# Altium schematic sheet PAGE2 - POWER.SchDoc
size A3; DocumentNumber: 2; SheetNumber: 2; SheetTotal: 2
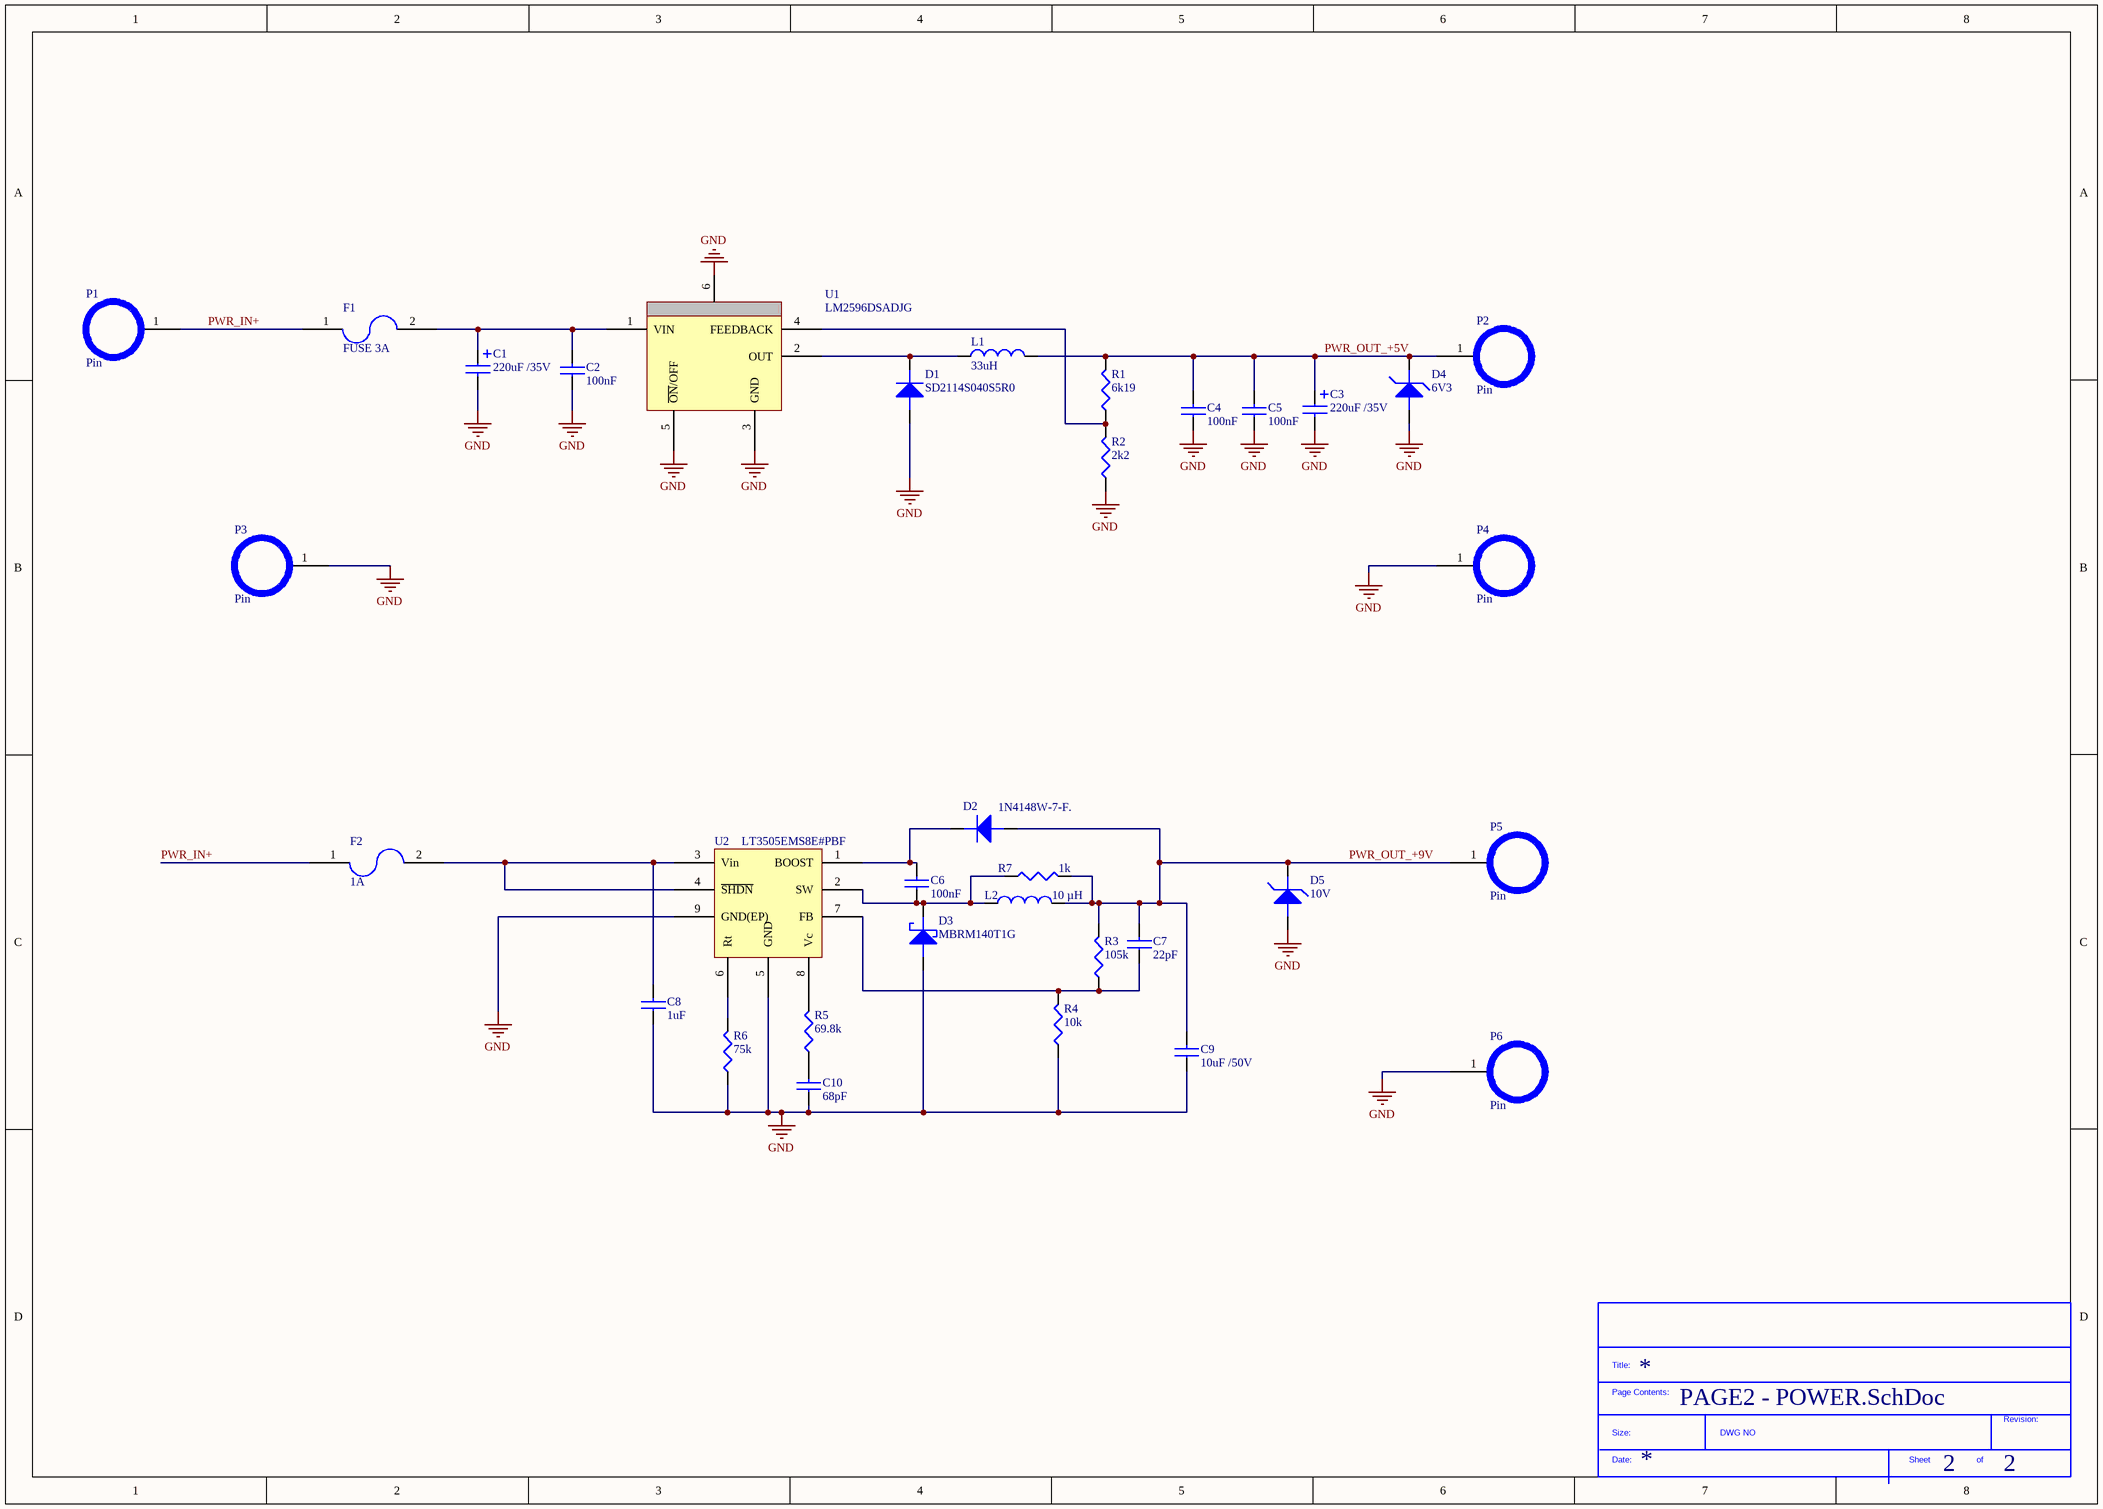
[diagram p0: PAGE2 - POWER.SchDoc]

## Parts
*?  SDTitleBlock  (value not drawn)  (graphical)
C1  220uF /35V  [Cap Can F]
C2  100nF  [CAP0603]
C3  220uF /35V  [Cap Can F]
C4  100nF  [CAP0603]
C5  100nF  [CAP0603]
C6  100nF  [CAP0603]
C7  22pF  [CAP0603]
C8  1uF  [CAP0603]
C9  10uF /50V  [CAP1206]
C10  68pF  [CAP0603]
D1  SD2114S040S5R0
D2  1N4148W-7-F.  [SOD123]
D3  MBRM140T1G  [POWERMITE]
D4  6V3
D5  10V
F1  FUSE 3A  [FUSE0805]
F2  1A  [FUSE0805]
L1  33uH  [IND DR125 Series]
L2  10 µH  [INDP6545X29N]
P1  Pin  [PCBComponent_1]  (no BOM)
P2  Pin  [PCBComponent_1]  (no BOM)
P3  Pin  [PCBComponent_1]  (no BOM)
P4  Pin  [PCBComponent_1]  (no BOM)
P5  Pin  [PCBComponent_1]  (no BOM)
P6  Pin  [PCBComponent_1]  (no BOM)
R1  6k19  [RES0603]
R2  2k2  [RES0603]
R3  105k  [RES0603]
R4  10k  [RES0603]
R5  69.8k  [RES0603]
R6  75k  [RES0603]
R7  1k  [RES0603]
U1  LM2596DSADJG  [KTT0005B]
U2  LT3505EMS8E#PBF  [MSOP8E]

## Nets
GND: C1.2 C2.1 C3.2 C4.1 C5.1 C8.1 C9.1 C10.1 D1.2(ANODE) D3.2(ANODE) D4.2(ANODE) D5.2(ANODE) P3.1 P4.1 P6.1 R2.1 R4.1 R6.1 U1.3(GND) U1.5(~{ON}/OFF) U1.6(EP) U2.5(GND) U2.9(GND(EP))
PWR_IN+: F1.1 F2.1 P1.1
PWR_OUT_+5V: C3.1 C4.2 C5.2 D4.1(cathode) L1.2 P2.1 R1.2
PWR_OUT_+9V: C7.2 C9.2 D2.2(ANODE) D5.1(cathode) L2.2 P5.1 R3.2 R7.2
NetC1_1: C1.1 C2.2 F1.2 U1.1(VIN)
NetC6_1: C6.1 D3.1(cathode) L2.1 R7.1 U2.2(SW)
NetC6_2: C6.2 D2.1(cathode) U2.1(BOOST)
NetC7_1: C7.1 R3.1 R4.2 U2.7(FB)
NetC8_2: C8.2 F2.2 U2.3(Vin) U2.4(~{SHDN})
NetC10_2: C10.2 R5.1
NetD1_1: D1.1(cathode) L1.1 U1.2(OUT)
NetR1_1: R1.1 R2.2 U1.4(FEEDBACK)
NetR5_2: R5.2 U2.8(Vc)
NetR6_2: R6.2 U2.6(Rt)

## Notes on the sheet
- (in symbol SDTitleBlock) Title:; Page Contents:; Revision:; Size:; DWG NO; Date:; Sheet; of

## Library data of the parts
C1 C3 = 220uF /35V: PANASONIC ELECTRONIC COMPONENTS - EEEFK1V221P - CAP, ALU ELEC, 220UF, 35V, SMD; Supplier 1: Farnell; Manufacturer: PANASONIC ELECTRONIC COMPONENTS; Manufacturer Part Number: EEEFK1V221P; RoHS: YES; Stock 1: 9435; Pricing 1: 1=0.596, 10=0.364, 50=0.262, 100=0.218, 200=0.187 (GBP); ComponentLink1URL: http://www.farnell.com/datasheets/2002520.pdf?_ga=1.182585071.878552343.1493119789; ComponentLink1Description: http://www.farnell.com/datasheets/2002520.pdf?_ga=1.182585071.878552343.1493119789; ComponentLink2URL: http://www.farnell.com/cad/1703920.zip; ComponentLink2Description: http://www.farnell.com/cad/1703920.zip; ComponentLink3URL: http://www.farnell.com/datasheets/2042572.pdf; ComponentLink3Description: http://www.farnell.com/datasheets/2042572.pdf; Supplier Part Number 1: 9695877
C2 C4-C6 = 100nF: MURATA - GRM188R71C104KA01J - CAP, MLCC, X7R, 0.1UF, 16V, 0603; Ceramic Capacitor Case: 0603 [1608 Metric]; Capacitance: 0.1; Voltage Rating: 16; Capacitance Tolerance: ± 10%; Dielectric Characteristic: X7; Product Range: GRM Series; SVHC: No SVHC (20-Jun-2016; Supplier 1: Farnell; Manufacturer: MURATA; Manufacturer Part Number: GRM188R71C104KA01J; RoHS: YES; Stock 1: 18297; Pricing 1: 10=0.0145, 100=0.0126, 500=0.0081, 2500=0.0059, 5000=0.0052, 10000=0.0046, 50000=0.0036, 100000=0.0035 (GBP); Packaging: Cut Tape; Operating Temperature Min: -55; Operating Temperature Max: 125; Automotive Qualification Standard: -; MSL: MSL 1 - Unlimited; ComponentLink1URL: http://www.farnell.com/datasheets/2189124.pdf; ComponentLink1Description: http://www.farnell.com/datasheets/2189124.pdf; Supplier Part Number 1: 2688519
C7 = 22pF: MURATA - GRM1885C1H220JA01D - CAP, MLCC, C0G/NP0, 22PF, 50V, 0603; Ceramic Capacitor Case: 0603 [1608 Metric]; Capacitance: 22; Voltage Rating: 50; Capacitance Tolerance: ± 5%; Product Range: GRM Series; SVHC: No SVHC (17-Dec-2015); Capacitor Terminals: SMD<!--FANDB--><div class="features-and-benefits-container"><div class="features-and-benefits-description"><span class="features-benefits-value">The Murata GRM series capacitors are Multilayer Ceramic Chip Capacitors (MLCC) used for general purpose applications. These MLCC capacitors are classified into temperature compensating and high dielectric constant types depending on the change in electrostatic capacitance due to change in temperature. The temperature compensating capacitors feature a small rate of change in electrostatic capacitance as the temperature changes and are used for applications such as filters and high frequency circuit matching. The high dielectric constant capacitors use materials with a high dielectric constant and feature a large electrostatic capacitance. Typical applications are power supply decoupling and smoothing circuits.</span></div><div class="features-and-benefits-list"><ul class="features-and-benefits-list-list"><li class="features-and-benefits-list-item">Large capacity and small size in a multilayer structure</li><li class="features-and-benefits-list-item">Capacitance value ranging from 0.1pF to 220?F</li><li class="features-and-benefits-list-item">Tin plated external electrodes, excellent solderability</li><li class="features-and-benefits-list-item">Provides good high frequency characteristics</li><li class="features-and-benefits-list-item">Excellent pulse response</li><li class="features-and-benefits-list-item">High reliability</li><li class="features-and-benefits-list-item">Capacitor size varies from 0.4×0.2mm to 5.7×5.0mm</li><li class="features-and-benefits-list-item">Rated voltage of 2.5VDC to 3.15; Supplier 1: Farnell; Manufacturer: MURATA; Manufacturer Part Number: GRM1885C1H220JA01D; RoHS: YES; Stock 1: 4736; Pricing 1: 10=0.0233, 100=0.0152, 500=0.0112, 1000=0.0088, 2000=0.0086 (GBP); Dielectric Characteristic: C0G / NP0; Packaging: Cut Tape; Operating Temperature Min: -55; Operating Temperature Max: 125; Automotive Qualification Standard: -; MSL: -; Capacitance Tolerance ±: ± 5%; ComponentLink1URL: http://www.farnell.com/datasheets/313472.pdf; ComponentLink1Description: http://www.farnell.com/datasheets/313472.pdf; ComponentLink2URL: http://www.farnell.com/datasheets/2048184.pdf; ComponentLink2Description: http://www.farnell.com/datasheets/2048184.pdf; Supplier Part Number 1: 8819831
C8 = 1uF: MURATA - GRM188R61H105KAALD - CAP, MLCC, X5R, 1UF, 50V, 0603; Ceramic Capacitor Case: 0603 [1608 Metric]; Capacitance: 1; Voltage Rating: 50; Capacitance Tolerance: ± 10%; Dielectric Characteristic: X5; Product Range: GRM Series; SVHC: No SVHC (17-Dec-2015); Capacitor Terminals: SMD<!--FANDB--><div class="features-and-benefits-container"><div class="features-and-benefits-description"><span class="features-benefits-value">The Murata GRM series capacitors are Multilayer Ceramic Chip Capacitors (MLCC) used for general purpose applications. These MLCC capacitors are classified into temperature compensating and high dielectric constant types depending on the change in electrostatic capacitance due to change in temperature. The temperature compensating capacitors feature a small rate of change in electrostatic capacitance as the temperature changes and are used for applications such as filters and high frequency circuit matching. The high dielectric constant capacitors use materials with a high dielectric constant and feature a large electrostatic capacitance. Typical applications are power supply decoupling and smoothing circuits.</span></div><div class="features-and-benefits-list"><ul class="features-and-benefits-list-list"><li class="features-and-benefits-list-item">Large capacity and small size in a multilayer structure</li><li class="features-and-benefits-list-item">Capacitance value ranging from 0.1pF to 220?F</li><li class="features-and-benefits-list-item">Tin plated external electrodes, excellent solderability</li><li class="features-and-benefits-list-item">Provides good high frequency characteristics</li><li class="features-and-benefits-list-item">Excellent pulse response</li><li class="features-and-benefits-list-item">High reliability</li><li class="features-and-benefits-list-item">Capacitor size varies from 0.4×0.2mm to 5.7×5.0mm</li><li class="features-and-benefits-list-item">Rated voltage of 2.5VDC to 3.15; Supplier 1: Farnell; Manufacturer: MURATA; Manufacturer Part Number: GRM188R61H105KAALD; RoHS: YES; Stock 1: 62682; Pricing 1: 10=0.093, 100=0.062, 500=0.0507, 1000=0.0465, 2000=0.0429, 4000=0.0399, 20000=0.0372, 40000=0.0365 (GBP); Packaging: Cut Tape; Operating Temperature Min: -55; Operating Temperature Max: 85; Automotive Qualification Standard: -; MSL: -; Capacitance Tolerance ±: ± 10%; ComponentLink1URL: http://www.farnell.com/datasheets/2048611.pdf; ComponentLink1Description: http://www.farnell.com/datasheets/2048611.pdf; Supplier Part Number 1: 1845736
C9 = 10uF /50V: MURATA - GRM31CR61H106KA12L - CAP, MLCC, X5R, 10UF, 50V, 1206; Supplier 1: Farnell; Manufacturer: MURATA; Manufacturer Part Number: GRM31CR61H106KA12L; RoHS: YES; Stock 1: 51830; Pricing 1: 5=0.368, 50=0.214, 250=0.196, 500=0.178, 1000=0.159 (GBP); ComponentLink1URL: http://www.farnell.com/datasheets/2048767.pdf; ComponentLink1Description: http://www.farnell.com/datasheets/2048767.pdf; Supplier Part Number 1: 1845762
C10 = 68pF: MURATA - GRM1885C1H680JA01D - CAP, MLCC, C0G/NP0, 68PF, 50V, 0603; Ceramic Capacitor Case: 0603 [1608 Metric]; Capacitance: 68; Voltage Rating: 50; Capacitance Tolerance: ± 5%; Product Range: GRM Series; SVHC: No SVHC (17-Dec-2015); Capacitor Terminals: SMD<!--FANDB--><div class="features-and-benefits-container"><div class="features-and-benefits-description"><span class="features-benefits-value">The Murata GRM series capacitors are Multilayer Ceramic Chip Capacitors (MLCC) used for general purpose applications. These MLCC capacitors are classified into temperature compensating and high dielectric constant types depending on the change in electrostatic capacitance due to change in temperature. The temperature compensating capacitors feature a small rate of change in electrostatic capacitance as the temperature changes and are used for applications such as filters and high frequency circuit matching. The high dielectric constant capacitors use materials with a high dielectric constant and feature a large electrostatic capacitance. Typical applications are power supply decoupling and smoothing circuits.</span></div><div class="features-and-benefits-list"><ul class="features-and-benefits-list-list"><li class="features-and-benefits-list-item">Large capacity and small size in a multilayer structure</li><li class="features-and-benefits-list-item">Capacitance value ranging from 0.1pF to 220?F</li><li class="features-and-benefits-list-item">Tin plated external electrodes, excellent solderability</li><li class="features-and-benefits-list-item">Provides good high frequency characteristics</li><li class="features-and-benefits-list-item">Excellent pulse response</li><li class="features-and-benefits-list-item">High reliability</li><li class="features-and-benefits-list-item">Capacitor size varies from 0.4×0.2mm to 5.7×5.0mm</li><li class="features-and-benefits-list-item">Rated voltage of 2.5VDC to 3.15; Supplier 1: Farnell; Manufacturer: MURATA; Manufacturer Part Number: GRM1885C1H680JA01D; RoHS: YES; Stock 1: 9555; Pricing 1: 10=0.0224, 100=0.0149, 500=0.0114, 1000=0.0086, 2000=0.0085 (GBP); Dielectric Characteristic: C0G / NP0; Packaging: Cut Tape; Operating Temperature Min: -55; Operating Temperature Max: 125; Automotive Qualification Standard: -; MSL: -; Capacitance Tolerance ±: ± 5%; ComponentLink1URL: http://www.farnell.com/datasheets/313472.pdf; ComponentLink1Description: http://www.farnell.com/datasheets/313472.pdf; ComponentLink2URL: http://www.farnell.com/datasheets/2048158.pdf; ComponentLink2Description: http://www.farnell.com/datasheets/2048158.pdf; Supplier Part Number 1: 8819858
D1 = SD2114S040S5R0: AVX - SD2114S040S5R0 - DIODE, SCHOTTKY, 5A, 40V, D0-214AA; Repetitive Reverse Voltage Vrrm Max: 40; Forward Current If(AV): 5; Diode Configuration: Single; Diode Case Style: DO-214; No. of Pins: 2; Forward Voltage VF Max: 550; Forward Surge Current Ifsm Max: 105; Product Range: SD211 Series; SVHC: No SVHC (17-Dec-2015); Supplier 1: Farnell; Manufacturer: AVX; Manufacturer Part Number: SD2114S040S5R0; RoHS: YES; Stock 1: 9585; Pricing 1: 1=0.6, 25=0.504, 100=0.393, 250=0.315, 500=0.237, 5000=0.205 (GBP); Operating Temperature Max: 125; Packaging: Cut Tape; Automotive Qualification Standard: -; Diode Type: Schottky; MSL: MSL 1 - Unlimited; Operating Temperature Min: -55°C<!--FANDB--><div class="features-and-benefits-container"><div class="features-and-benefits-description"><span class="features-benefits-value">The SD2114S040S5R0 is a Schottky Barrier Rectifier Diode in FRP substrate with epoxy under-fill case and solderable lead-free tin-plated per MIL-STD-750 terminals. It offers unique lead-less chip which technology eliminates the lead frame wire bond to give the chip top-bottom symmetry for fewer mounting problems, better heat transfer and current handling capability (compared to SOD devices). It is suitable for use in switch mode power supplies, high-frequency rectification and reverse bias protection applications.</span></div><div class="features-and-benefits-list"><ul class="features-and-benefits-list-list"><li class="features-and-benefits-list-item">High-current capability</li><li class="features-and-benefits-list-item">Low-power loss/high-efficiency</li><li class="features-and-benefits-list-item">Halogen-free</li></ul></div><div class="features-and-benefits-applications"><ul class="features-and-benefits-value"><li class="features-and-benefits-list-item">Power Management</li><li class="features-and-benefits-list-item">Industrial</li><li class="features-and-benefits-list-item">Aerospace, Defence, Military</li></ul></div></div>; ComponentLink1URL: http://www.farnell.com/datasheets/2239358.pdf; ComponentLink1Description: http://www.farnell.com/datasheets/2239358.pdf; Supplier Part Number 1: 2400187
D2 = 1N4148W-7-F.: DIODES INC. - 1N4148W-7-F. - DIODE, SWITCH, 300MA, 100V,SOD123; Diode Configuration: Single; Repetitive Reverse Voltage Vrrm Max: 100; Forward Current If(AV): 300; Forward Voltage VF Max: 1.25; Reverse Recovery Time trr Max: 4; Forward Surge Current Ifsm Max: 2; Diode Case Style: SOD-123; Product Range: 1N4148 Series; SVHC: No SVHC (17-Dec-2015); Diode Type: Switching; Supplier 1: Farnell; Manufacturer: DIODES INC.; Manufacturer Part Number: 1N4148W-7-F.; RoHS: YES; Stock 1: 157320; Pricing 1: 1=0.136, 25=0.132, 100=0.0465, 500=0.042, 1000=0.024, 3000=0.021, 9000=0.017, 30000=0.0149 (GBP); Operating Temperature Max: 150; No. of Pins: 2; Packaging: Cut Tape; Automotive Qualification Standard: -; MSL: MSL 1 - Unlimited; Operating Temperature Min: -65; Operating Temperature Range: -65°C to +150°C<!--FANDB--><div class="features-and-benefits-container"><div class="features-and-benefits-description"><span class="features-benefits-value">The 1N4148W-7-F is a surface mount fast Switching Diode with moulded plastic case. Suitable for general purpose switching applications.</span></div><div class="features-and-benefits-list"><ul class="features-and-benefits-list-list"><li class="features-and-benefits-list-item">Fast Switching Speed</li><li class="features-and-benefits-list-item">2; ComponentLink1URL: http://www.farnell.com/datasheets/2238378.pdf; ComponentLink1Description: http://www.farnell.com/datasheets/2238378.pdf; Supplier Part Number 1: 1776392
D3 = MBRM140T1G: ON SEMICONDUCTOR - MBRM140T1G - DIODE, SCHOTTKY, 1A, POWERMITE; Supplier 1: Farnell; Manufacturer: ON SEMICONDUCTOR; Manufacturer Part Number: MBRM140T1G; RoHS: YES; Stock 1: 7058; Pricing 1: 5=0.259, 50=0.134, 250=0.123, 500=0.092, 1500=0.0881 (GBP); ComponentLink1URL: http://www.onsemi.com/PowerSolutions/supportDoc.do?type=models&rpn=MBRM140; ComponentLink1Description: http://www.onsemi.com/PowerSolutions/supportDoc.do?type=models&rpn=MBRM140; ComponentLink2URL: http://www.farnell.com/datasheets/1708273.pdf; ComponentLink2Description: http://www.farnell.com/datasheets/1708273.pdf; ComponentLink3URL: http://www.farnell.com/datasheets/2036933.pdf; ComponentLink3Description: http://www.farnell.com/datasheets/2036933.pdf; Supplier Part Number 1: 1459067
D4 = Zener diode 6V3: VISHAY - BZM55C6V2-TR - DIODE, ZENER, 6.2V, 0.5W; Zener Voltage Vz Typ: 6.2; Power Dissipation Pd: 500; Diode Case Style: MicroMELF; Zener Tolerance ±: 5%; No. of Pins: 2; Product Range: BZM55 Series; Automotive Qualification Standard: AEC-Q101; Test Current: 5; Supplier 1: Farnell; Manufacturer: VISHAY; Manufacturer Part Number: BZM55C6V2-TR; RoHS: Y-EX; Stock 1: 14419; Pricing 1: 1=0.143, 25=0.138, 100=0.066, 250=0.0524, 1000=0.0339, 2000=0.0266, 6000=0.0226, 20000=0.0207 (GBP); Operating Temperature Max: 175; Packaging: Cut Tape; MSL: MSL 1 - Unlimited; Operating Temperature Min: -65; Operating Temperature Range: -65°C to +175; Power Dissipation Max: 500; Power Dissipation Ptot Max: 500; Termination Type: Surface Mount Device; ComponentLink1URL: http://www.farnell.com/datasheets/2047097.pdf; ComponentLink1Description: http://www.farnell.com/datasheets/2047097.pdf; Supplier Part Number 1: 1469416
D5 = Zener diode 10V: VISHAY - BZM55C10-TR - DIODE, ZENER, VZ 10V; Zener Voltage Vz Typ: 10; Power Dissipation Pd: 500; Diode Case Style: MicroMELF; Zener Tolerance ±: 5%; No. of Pins: 2; Product Range: BZM55 Series; Automotive Qualification Standard: AEC-Q101; Test Current: 5; Supplier 1: Farnell; Manufacturer: VISHAY; Manufacturer Part Number: BZM55C10-TR; RoHS: Y-EX; Stock 1: 8754; Pricing 1: 1=0.144, 25=0.138, 50=0.134, 100=0.0656, 500=0.034, 2000=0.0266, 6000=0.0226, 20000=0.0207 (GBP); Operating Temperature Max: 175; Packaging: Cut Tape; MSL: MSL 1 - Unlimited; Operating Temperature Min: -65; Operating Temperature Range: -65°C to +175; Power Dissipation Max: 500; Termination Type: Surface Mount Device; ComponentLink1URL: http://www.farnell.com/datasheets/2047097.pdf; ComponentLink1Description: http://www.farnell.com/datasheets/2047097.pdf; Supplier Part Number 1: 1651600
F1 = FUSE SMD0805 3A: VISHAY - MFU0805FF03000P100 - FUSE, 0805 SMD, 3A; Supplier 1: Farnell; Manufacturer: VISHAY; Manufacturer Part Number: MFU0805FF03000P100; RoHS: Y-EX; Stock 1: 616; Pricing 1: 1=0.548, 50=0.382, 100=0.292, 250=0.265, 500=0.225, 1000=0.166, 5000=0.163, 10000=0.157 (GBP); ComponentLink1URL: http://www.farnell.com/datasheets/2243611.pdf; ComponentLink1Description: http://www.farnell.com/datasheets/2243611.pdf; Supplier Part Number 1: 2057187
F2 = MCF0805B1R00FSTR FUSE SMD0805 1A: MULTICOMP - MCF0805B1R00FSTR - FUSE, SMD, 0805, 1A; Fuse Current: 1; Voltage Rating V DC: 63; Blow Characteristic: Fast Acting; Fuse Case Style: 0805; Breaking Capacity Current DC: 50; SVHC: No SVHC (17-Dec-2015); Supplier 1: Farnell; Manufacturer: MULTICOMP; Manufacturer Part Number: MCF0805B1R00FSTR; RoHS: YES; Stock 1: 7549; Pricing 1: 10=0.587, 50=0.475, 100=0.43, 250=0.403, 500=0.32, 3000=0.215 (GBP); Product Range: MCF0805; Voltage Rating V AC: -; Breaking Capacity Current AC: -; Packaging: Cut Tape<!--FANDB--><div class="features-and-benefits-container"></div>; ComponentLink1URL: http://www.farnell.com/datasheets/2019197.pdf; ComponentLink1Description: http://www.farnell.com/datasheets/2019197.pdf; Supplier Part Number 1: 1337418
L1 = 33uH: COILTRONICS - DR125-330-R - INDUCTOR, SMD, 33UH, 3.28A; Product Range: DR Series; Inductance: 33; RMS Current (Irms): 3.28; Saturation Current (Isat): 3.84; Inductor Construction: Shielded; Power Inductor Case: 12.5mm x 12.5mm x 6; Inductance Tolerance: ± 20%; SVHC: No SVHC (15-Jun-2015); No. of Pins: 2Pins<!--FANDB--><div class="features-and-benefits-container"><div class="features-and-benefits-description"><span class="features-benefits-value">The DR125-330-R is a 33; Supplier 1: Farnell; Manufacturer: COILTRONICS; Manufacturer Part Number: DR125-330-R; RoHS: YES; Stock 1: 5001; Pricing 1: 1=1.53, 10=1.02, 50=0.765, 100=0.68, 200=0.612, 600=0.51, 3000=0.456, 6000=0.447 (GBP); DC Resistance Max: -; Packaging: Cut Tape; ComponentLink1URL: http://www.farnell.com/datasheets/87246.pdf; ComponentLink1Description: http://www.farnell.com/datasheets/87246.pdf; Supplier Part Number 1: 2075603
L2 = SDR0703-100KL: BOURNS - SDR0703-100KL - INDUCTOR, POWER, 10UH, 10%, 1A; Product Range: SDR0703 Series; Inductance: 10; RMS Current (Irms): 1; Saturation Current (Isat): 1.4; Inductor Construction: Unshielded; DC Resistance Max: 0.17; Power Inductor Case: 6.5mm x 4.5mm x 2.7; SVHC: No SVHC (20-Jun-2016); No. of Pins: 2; Q Factor: 23; Q Test Frequency: 2.52; Self Resonant Frequency Min: 36MHz<!--FANDB--><div class="features-and-benefits-container"><div class="features-and-benefits-description"><span class="features-benefits-value">The SDR0703 series SMD Power Inductor with ferrite core and tin/silver termination. It has liquid-crystal polymer and 6020H-6 adhesive and an enamelled copper wire winding. It is suitable for input/output of DC/DC converters.</span></div><div class="features-and-benefits-list"><ul class="features-and-benefits-list-list"><li class="features-and-benefits-list-item">Available in E12 series</li><li class="features-and-benefits-list-item">Low height of only 2.7; Supplier 1: Farnell; Manufacturer: BOURNS; Manufacturer Part Number: SDR0703-100KL; RoHS: YES; Stock 1: 176; Pricing 1: 1=0.594, 10=0.44, 50=0.338, 100=0.303, 200=0.274, 500=0.251, 2500=0.214, 5000=0.194 (GBP); Inductance Tolerance: ± 10%; Packaging: Cut Tape; Lead Spacing: 4; ComponentLink1URL: http://www.bourns.com/engineering/SDR0703/sdr0703.stp; ComponentLink1Description: http://www.bourns.com/engineering/SDR0703/sdr0703.stp; ComponentLink2URL: http://www.farnell.com/datasheets/707207.pdf; ComponentLink2Description: http://www.farnell.com/datasheets/707207.pdf; Supplier Part Number 1: 1929709
P1-P6 = Pin: Pin for board to board connection
R1 = 6k19: MULTICOMP - MCSR06X6191FTL - RES, CERAMIC, 6K19, 1%, 0.1W, 0603; Resistance: 6.19; Voltage Rating: 75; Resistor Case Style: 0603 [1608 Metric]; Power Rating: 100; Product Range: MCSR 06 Series; Temperature Coefficient: ± 100; SVHC: No SVHC (12-Jan-2017); Resistor Mounting: Surface Mount Device<!--FANDB--><div class="features-and-benefits-container"></div>; Supplier 1: Farnell; Manufacturer: MULTICOMP; Manufacturer Part Number: MCSR06X6191FTL; RoHS: Y-EX; Stock 1: 3861; Pricing 1: 10=0.0129, 100=0.0106, 500=0.0082, 1000=0.0062, 2500=0.0044, 5000=0.0034, 25000=0.0024, 50000=0.0021 (GBP); Resistance Tolerance: ± 1%; Packaging: Cut Tape; Resistor Element Material: Ceramic; Automotive Qualification Standard: -; ComponentLink1URL: http://www.farnell.com/datasheets/1716711.pdf; ComponentLink1Description: http://www.farnell.com/datasheets/1716711.pdf; Supplier Part Number 1: 2074287
R2 = 2k2: MULTICOMP - MCMR06X2201FTL - RES, CERAMIC, 2K2, 1%, 0.1W, 0603; Supplier 1: Farnell; Manufacturer: MULTICOMP; Manufacturer Part Number: MCMR06X2201FTL; RoHS: Y-EX; Stock 1: 17638; Pricing 1: 10=0.0099, 100=0.0059, 500=0.0042, 1000=0.0033, 2500=0.0027 (GBP); ComponentLink1URL: http://www.farnell.com/datasheets/1716707.pdf; ComponentLink1Description: http://www.farnell.com/datasheets/1716707.pdf; Supplier Part Number 1: 2073429
R3 = 105k: MULTICOMP - MC0063W06031105K - RES, THICK FILM, 105K, 1%, 0.063W, 0603; Resistance: 105; Voltage Rating: 50; Resistor Case Style: 0603 [1608 Metric]; Power Rating: 63; Product Range: MC Series; Temperature Coefficient: ± 100; SVHC: No SVHC (12-Jan-2017); External Depth: 0.45; External Length / Height: 1.6; External Width: 0.8; No. of Pins: 2; Reel Quantity: 5000; Resistor Mounting: Surface Mount Device; Temperature Coeff. +: 100; Voltage Rating V DC: 50V<!--FANDB--><div class="features-and-benefits-container"><div class="features-and-benefits-description"><span class="features-benefits-value">The Multicomp MC series current sense resistors are thick film chip resistors. The resistance range includes E96 and E24 decade values from 1ohm to 10Mohm.</span></div><div class="features-and-benefits-list"><ul class="features-and-benefits-list-list"><li class="features-and-benefits-list-item">EIA 0402, 0603, 0805, 1206 chip sizes available</li><li class="features-and-benefits-list-item">Small size and low weight</li><li class="features-and-benefits-list-item">Suitable for both wave and reflow soldering</li><li class="features-and-benefits-list-item">Reduction of assembly costs</li><li class="features-and-benefits-list-item">Maximum working voltage of 50V(0402, 0603), 150V(0805), 200V(1206)</li><li class="features-and-benefits-list-item">Available in ±1%, ±2% and ±5% tolerance</li><li class="features-and-benefits-list-item">Power rating of 62.5mW, 100mW and 125mW</li><li class="features-and-benefits-list-item">±400ppm/°C(1ohm to 10ohm), ±200ppm/°C(11ohm to 100ohm), ±100; Supplier 1: Farnell; Manufacturer: MULTICOMP; Manufacturer Part Number: MC0063W06031105K; RoHS: Y-EX; Stock 1: 8970; Pricing 1: 10=0.0011, 100=0.001, 500=0.0009, 1000=0.0008, 2500=0.0007 (GBP); Resistance Tolerance: ± 1%; Packaging: Cut Tape; Resistor Element Material: Thick Film; Automotive Qualification Standard: -; Operating Temperature Max: 155; Operating Temperature Min: -55; Operating Temperature Range: -55°C to +155; Tape Width: 8; Temperature Coeff. -: 100; Tolerance +: 1%; Tolerance -: 1%; ComponentLink1URL: http://www.farnell.com/datasheets/1788326.pdf; ComponentLink1Description: http://www.farnell.com/datasheets/1788326.pdf; Supplier Part Number 1: 1170988
R4 = 10k: MULTICOMP - MCMR06X103 JTL - RES, CERAMIC, 10K, 5%, 0.1W, 0603; Resistance: 10; Voltage Rating: 75; Resistor Case Style: 0603 [1608 Metric]; Power Rating: 100; Product Range: MCMR Series; Temperature Coefficient: ± 100; Automotive Qualification Standard: -<!--FANDB--><div class="features-and-benefits-container"><div class="features-and-benefits-description"><span class="features-benefits-value">The Multicomp MCMR series resistors are automotive grade, anti sulphured thick film chip resistor. The resistance range includes E24 and E96 decade values from 1ohm to 10Mohm. These resistors are constructed on top of a high grade ceramic body.</span></div><div class="features-and-benefits-list"><ul class="features-and-benefits-list-list"><li class="features-and-benefits-list-item">EIA 0402, 0603, 0805, 1206 chip sizes available</li><li class="features-and-benefits-list-item">High reliability and stability</li><li class="features-and-benefits-list-item">Automotive grade AEC-Q200 compliant</li><li class="features-and-benefits-list-item">Complaint with (IEC 60068-1) 55/155/56 climatic category</li><li class="features-and-benefits-list-item">Maximum operation voltage of 50V, 75V, 150V and 200V</li><li class="features-and-benefits-list-item">Power rating of 62.5mW, 100mW, 125mW and 250mW</li><li class="features-and-benefits-list-item">Available in ±1% and ±5% tolerance</li><li class="features-and-benefits-list-item">Temperature coefficient (TCR) of +200ppm/°C, +100ppm/°C and -200ppm/°C to +400ppm/°C</li><li class="features-and-benefits-list-item">Operating temperature range -55°C to 155; Supplier 1: Farnell; Manufacturer: MULTICOMP; Manufacturer Part Number: MCMR06X103 JTL; RoHS: Y-EX; Stock 1: 19791; Pricing 1: 10=0.0087, 100=0.0074, 500=0.0061, 1000=0.0048, 2500=0.0032, 5000=0.0024, 25000=0.0016, 50000=0.0013 (GBP); Resistance Tolerance: ± 5%; Packaging: Cut Tape; Resistor Element Material: Ceramic; ComponentLink1URL: http://www.farnell.com/datasheets/1716707.pdf; ComponentLink1Description: http://www.farnell.com/datasheets/1716707.pdf; Supplier Part Number 1: 2073356
R5 = 69.8k: MULTICOMP - MC0063W0603169K8 - RES, THICK FILM, 69K8, 1%, 0.063W, 0603; Resistance: 69.8; Voltage Rating: 50; Resistor Case Style: 0603 [1608 Metric]; Power Rating: 63; Product Range: MC Series; Temperature Coefficient: ± 100; SVHC: No SVHC (12-Jan-2017); External Depth: 0.45; External Length / Height: 1.6; External Width: 0.8; No. of Pins: 2; Reel Quantity: 5000; Resistor Mounting: Surface Mount Device; Temperature Coeff. +: 100; Supplier 1: Farnell; Manufacturer: MULTICOMP; Manufacturer Part Number: MC0063W0603169K8; RoHS: Y-EX; Stock 1: 4756; Pricing 1: 10=0.0115, 100=0.0089, 500=0.0063, 1000=0.0051, 2500=0.0042, 5000=0.0032, 25000=0.0021, 50000=0.0017 (GBP); Resistance Tolerance: ± 1%; Packaging: Cut Tape; Resistor Element Material: Thick Film; Automotive Qualification Standard: -; Operating Temperature Max: 155; Operating Temperature Min: -55; Operating Temperature Range: -55°C to +155; Tape Width: 8; Temperature Coeff. -: 100; Tolerance +: 1%; Tolerance -: 1%; Voltage Rating V DC: 50; ComponentLink1URL: http://www.farnell.com/datasheets/1788326.pdf; ComponentLink1Description: http://www.farnell.com/datasheets/1788326.pdf; Supplier Part Number 1: 1170972
R6 = 75k: MULTICOMP - MCSR06X7502FTL - RES, CERAMIC, 75K, 1%, 0.1W, 0603; Supplier 1: Farnell; Manufacturer: MULTICOMP; Manufacturer Part Number: MCSR06X7502FTL; RoHS: Y-EX; Stock 1: 1882; Pricing 1: 10=0.0145, 100=0.0113, 500=0.008, 1000=0.0064, 2500=0.004, 5000=0.0031, 25000=0.0021, 50000=0.002 (GBP); ComponentLink1URL: http://www.farnell.com/datasheets/1716711.pdf; ComponentLink1Description: http://www.farnell.com/datasheets/1716711.pdf; Supplier Part Number 1: 2074304
R7 = 1k: MULTICOMP - MCMR06X102 JTL - RES, CERAMIC, 1K, 5%, 0.1W, 0603; Resistance: 1; Voltage Rating: 75; Resistor Case Style: 0603 [1608 Metric]; Power Rating: 100; Product Range: MCMR Series; Temperature Coefficient: ± 100; Resistor Mounting: Surface Mount Device<!--FANDB--><div class="features-and-benefits-container"><div class="features-and-benefits-description"><span class="features-benefits-value">The Multicomp MCMR series resistors are automotive grade, anti sulphured thick film chip resistor. The resistance range includes E24 and E96 decade values from 1ohm to 10Mohm. These resistors are constructed on top of a high grade ceramic body.</span></div><div class="features-and-benefits-list"><ul class="features-and-benefits-list-list"><li class="features-and-benefits-list-item">EIA 0402, 0603, 0805, 1206 chip sizes available</li><li class="features-and-benefits-list-item">High reliability and stability</li><li class="features-and-benefits-list-item">Automotive grade AEC-Q200 compliant</li><li class="features-and-benefits-list-item">Complaint with (IEC 60068-1) 55/155/56 climatic category</li><li class="features-and-benefits-list-item">Maximum operation voltage of 50V, 75V, 150V and 200V</li><li class="features-and-benefits-list-item">Power rating of 62.5mW, 100mW, 125mW and 250mW</li><li class="features-and-benefits-list-item">Available in ±1% and ±5% tolerance</li><li class="features-and-benefits-list-item">Temperature coefficient (TCR) of +200ppm/°C, +100ppm/°C and -200ppm/°C to +400ppm/°C</li><li class="features-and-benefits-list-item">Operating temperature range -55°C to 155; Supplier 1: Farnell; Manufacturer: MULTICOMP; Manufacturer Part Number: MCMR06X102 JTL; RoHS: Y-EX; Stock 1: 18133; Pricing 1: 10=0.0089, 100=0.0076, 500=0.0063, 1000=0.0049, 2500=0.0033, 5000=0.0024, 25000=0.0016, 50000=0.0013 (GBP); Resistance Tolerance: ± 5%; Packaging: Cut Tape; Resistor Element Material: Ceramic; Automotive Qualification Standard: -; ComponentLink1URL: http://www.farnell.com/datasheets/1716707.pdf; ComponentLink1Description: http://www.farnell.com/datasheets/1716707.pdf; Supplier Part Number 1: 2073354
U1 = LM2596DSADJG: ON SEMICONDUCTOR - LM2596DSADJG - DC/DC CONV, BUCK, 3A, 150KHZ, TO-263-5; Topology: Buck (Step Down); Input Voltage Min: 4.5; Input Voltage Max: 45; No. of Outputs: 1; DC / DC Converter IC Case: TO-263; No. of Pins: 5; Output Current: 3; Output Voltage Min: 1.23; Output Voltage Max: 37; Switching Frequency: 150; SVHC: No SVHC (12-Jan-2017; Supplier 1: Farnell; Manufacturer: ON SEMICONDUCTOR; Manufacturer Part Number: LM2596DSADJG; RoHS: YES; Stock 1: 342; Pricing 1: 1=1.98, 10=1.49, 100=1.19, 500=1.04, 1000=0.859, 2500=0.785 (GBP); Operating Temperature Max: 125; Packaging: Each; Product Range: -; Automotive Qualification Standard: -; MSL: MSL 1 - Unlimited; ComponentLink1URL: http://www.farnell.com/datasheets/2031954.pdf; ComponentLink1Description: http://www.farnell.com/datasheets/2031954.pdf; Supplier Part Number 1: 2534162
U2 = LT3505EMS8E#PBF: LINEAR TECHNOLOGY - LT3505EMS8E#PBF - IC, SW REG, 1.2A, STEP D, 8MSOP; Topology: Buck (Step Down); Input Voltage Min: 3.6; Input Voltage Max: 36; No. of Outputs: 1; DC / DC Converter IC Case: MSOP; No. of Pins: 8; Output Current: 1.2; Output Voltage Min: 780; Output Voltage Max: 31.32; Switching Frequency: 3; SVHC: No SVHC (17-Dec-2015); Base Number: 3505; Voltage Regulator Type: Step Down (Buck)<!--FANDB--><div class="features-and-benefits-container"><div class="features-and-benefits-description"><span class="features-benefits-value">The LT3505EMS8E#PBF is a current-mode PWM step-down DC-to-DC Converter with an internal 1.4A power switch. The wide operating input range of 3.6 to 36V (40V maximum) makes the LT3505 ideal for regulating power from a wide variety of sources, including unregulated wall transformers and 24; Supplier 1: Farnell; Manufacturer: LINEAR TECHNOLOGY; Manufacturer Part Number: LT3505EMS8E#PBF; RoHS: YES; Pricing 1: 1=4.65, 25=2.98, 100=2.49 (GBP); Operating Temperature Max: 85; Packaging: Cut Tape; Product Range: -; Automotive Qualification Standard: -; MSL: MSL 1 - Unlimited; Adjustable Output Voltage Min: 780; Frequency: 3; Operating Temperature Min: -40; Operating Temperature Range: -40°C to +85; Primary Input Voltage: 36; Supply Voltage Min: 3.6; Switch Output Current Isw Max: 1; Termination Type: Surface Mount Device; ComponentLink1URL: http://www.farnell.com/simulation/1753236.zip; ComponentLink1Description: http://www.farnell.com/simulation/1753236.zip; ComponentLink2URL: http://www.farnell.com/datasheets/1898069.pdf; ComponentLink2Description: http://www.farnell.com/datasheets/1898069.pdf; Supplier Part Number 1: 1663569